# Altium project Workshop2.PrjPcb
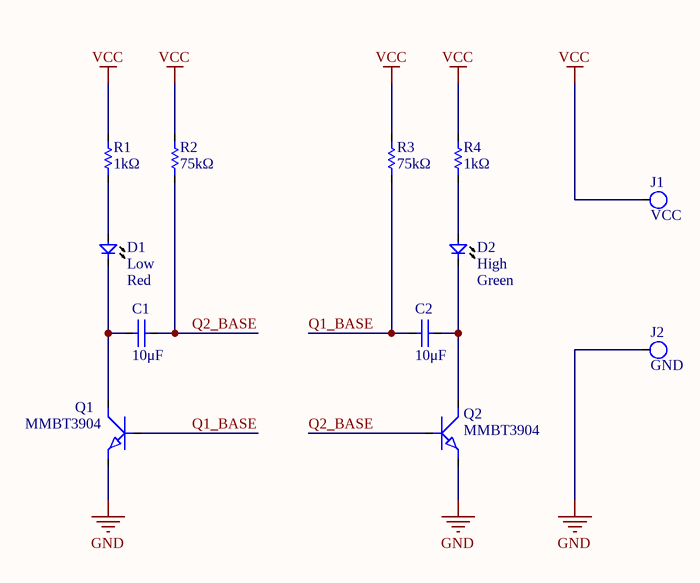
[diagram p0: Sheet1.SchDoc]
1 sheet, 12 parts. Net scope: global (net labels, ports and power ports of the same name join across sheets).
Board file: PCB1.PcbDoc

## Sheet Sheet1.SchDoc
size A4; SheetNumber: 1; SheetTotal: 1

### Parts
C1  10μF  [0805_CAP]
C2  10μF  [0805_CAP]
D1  Low  Color: Red  [0805_DIODE]
D2  High  Color: Green  [0805_DIODE]
J1  VCC  [PIN_1MM]
J2  GND  [PIN_1MM]
Q1  MMBT3904  [SOT23-3]
Q2  MMBT3904  [SOT23-3]
R1  1kΩ  [0805_RES]
R2  75kΩ  [0805_RES]
R3  75kΩ  [0805_RES]
R4  1kΩ  [0805_RES]

### Nets
GND: J2.1(J) Q1.2(E) Q2.2(E)
VCC: J1.1(J) R1.2 R2.2 R3.2 R4.2
Q1_BASE: C2.2 Q1.1(B) R3.1
Q2_BASE: C1.1 Q2.1(B) R2.1
NetC1_2: C1.2 D1.K Q1.3(C)
NetC2_1: C2.1 D2.K Q2.3(C)
NetD1_A: D1.A R1.1
NetD2_A: D2.A R4.1

### Library data of the parts
C1 C2 = C: Generic non-polarised capacitor.; Revision: July-2002: Re-released for DXP Platform.; Value: 10μF
D1 = LED: Generic LED.; Revision: July-2002: Re-released for DXP Platform.; Value: Low
D2 = LED: Generic LED.; Value: Power; Revision: July-2002: Re-released for DXP Platform.
J1 J2 = TEST_POINT: Generic wire-to-board point or test point.; Value: Test Point
Q1 Q2 = NPN_BJT: Generic NPN bipolar transistor.; Value: MMBT3904
R1-R4 = R: Generic resistor.
  R1 R4: Value: 1kΩ
  R2 R3: Value: 75kΩ